# EAGLE schematic decoder (EAGLE 7.3.0)
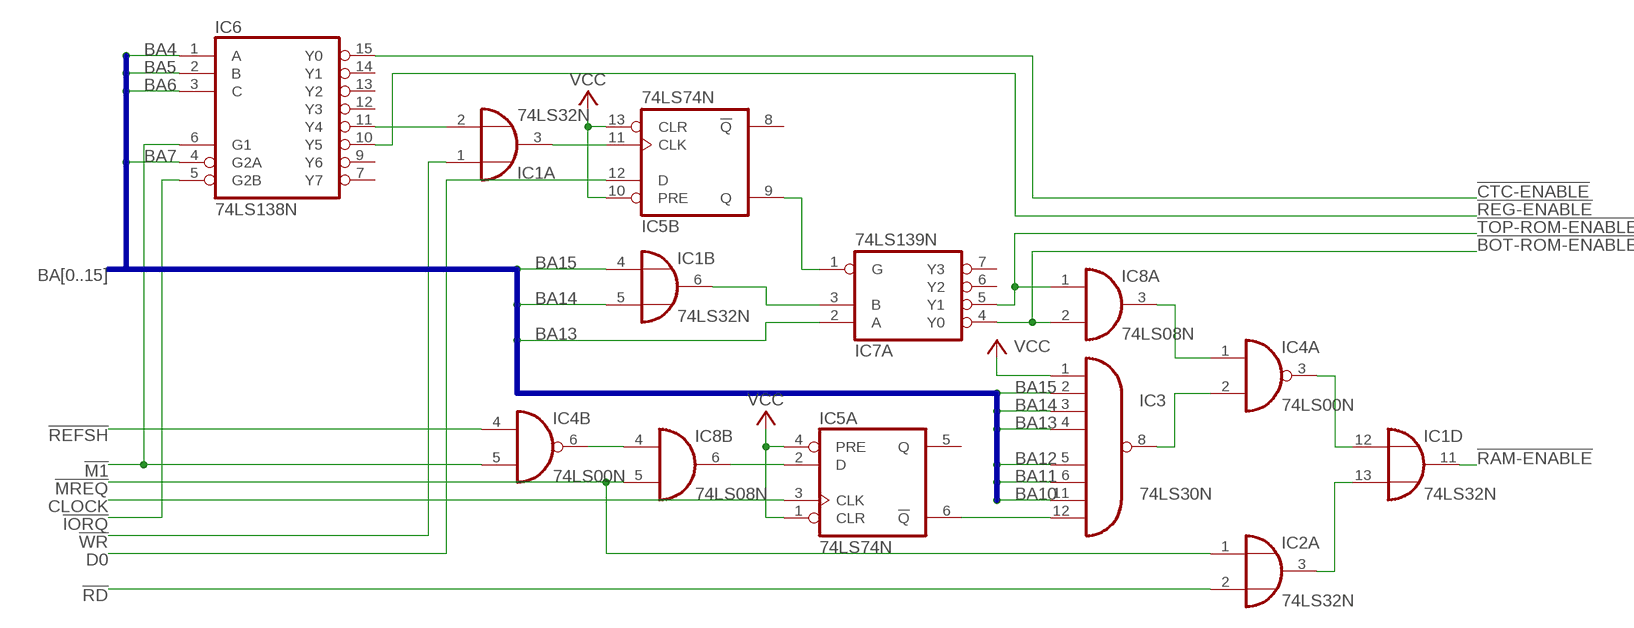
[diagram p0: schematic, sheet 1]

## Parts
IC1  74LS32N  [DIL14]
IC2  74LS32N  [DIL14]
IC3  74LS30N  [DIL14]
IC4  74LS00N  [DIL14]
IC5  74LS74N  [DIL14]
IC6  74LS138N  [DIL16]
IC7  74LS139N  [DIL16]
IC8  74LS08N  [DIL14]

## Nets
!BOT-ROM-ENABLE!: IC7.4(A:Y0) IC8.2(A:I1)
!CTC-ENABLE!: IC6.15(Y0)
!IORQ!: IC6.5(G2B)
!M1!: IC4.5(B:I1) IC6.6(G1)
!MREQ!: IC2.1(A:I0) IC8.5(B:I1)
!RAM-ENABLE!: IC1.11(D:O)
!RD!: IC2.2(A:I1)
!REFSH!: IC4.4(B:I0)
!REG-ENABLE!: IC6.10(Y5)
!TOP-ROM-ENABLE!: IC7.5(A:Y1) IC8.1(A:I0)
!WR!: IC1.1(A:I0)
BA4: IC6.1(A)
BA5: IC6.2(B)
BA6: IC6.3(C)
BA7: IC6.4(G2A)
BA10: IC3.11(I6)
BA11: IC3.6(I5)
BA12: IC3.5(I4)
BA13: IC3.4(I3) IC7.2(A:A)
BA14: IC1.5(B:I1) IC3.3(I2)
BA15: IC1.4(B:I0) IC3.2(I1)
CLOCK: IC5.3(A:CLK)
D0: IC5.12(B:D)
N$1: IC1.3(A:O) IC5.11(B:CLK)
N$2: IC5.9(B:Q) IC7.1(A:G)
N$3: IC1.2(A:I1) IC6.11(Y4)
N$4: IC1.6(B:O) IC7.3(A:B)
N$5: IC4.1(A:I0) IC8.3(A:O)
N$6: IC3.8(O) IC4.2(A:I1)
N$7: IC3.12(I7) IC5.6(A:!Q)
N$8: IC5.2(A:D) IC8.6(B:O)
N$9: IC4.6(B:O) IC8.4(B:I0)
N$14: IC1.12(D:I0) IC4.3(A:O)
N$15: IC1.13(D:I1) IC2.3(A:O)
VCC: IC3.1(I0) IC5.1(A:CLR) IC5.4(A:PRE) IC5.10(B:PRE) IC5.13(B:CLR)
Unconnected: IC1.8(C:O) IC1.9(C:I0) IC1.10(C:I1) IC2.4(B:I0) IC2.5(B:I1) IC2.6(B:O) IC2.8(C:O) IC2.9(C:I0) IC2.10(C:I1) IC2.11(D:O) IC2.12(D:I0) IC2.13(D:I1) IC4.8(C:O) IC4.9(C:I0) IC4.10(C:I1) IC4.11(D:O) IC4.12(D:I0) IC4.13(D:I1) IC5.5(A:Q) IC5.8(B:!Q) IC6.7(Y7) IC6.9(Y6) IC6.12(Y3) IC6.13(Y2) IC6.14(Y1) IC7.6(A:Y2) IC7.7(A:Y3) IC7.9(B:Y3) IC7.10(B:Y2) IC7.11(B:Y1) IC7.12(B:Y0) IC7.13(B:B) IC7.14(B:A) IC7.15(B:G) IC8.8(C:O) IC8.9(C:I0) IC8.10(C:I1) IC8.11(D:O) IC8.12(D:I0) IC8.13(D:I1)

## Buses
BA[0..15]

## Power pins joined to a net without a drawn wire
GND: IC1.7(P:GND) IC2.7(P:GND) IC3.7(GND) IC4.7(P:GND) IC5.7(P:GND) IC6.8(GND) IC7.8(P:GND) IC8.7(P:GND)
VCC: IC1.14(P:VCC) IC2.14(P:VCC) IC3.14(VCC) IC4.14(P:VCC) IC5.14(P:VCC) IC6.16(VCC) IC7.16(P:VCC) IC8.14(P:VCC)

## Library data of the parts
IC1 IC2 = 74xx-eu:74*32: Quad 2-input OR gate
IC3 = 74xx-eu:74*30: 8-input NAND gate
IC4 = 74xx-eu:74*00: Quad 2-input NAND gate
IC5 = 74xx-eu:74*74: Dual D type positive edge triggered FLIP FLOP, preset and clear
IC6 = 74xx-eu:74*138: 3-line to 8-line DECODER/DEMULTIPLEXER
IC7 = 74xx-eu:74*139: Dual 2-line to 4-line DECODER/DEMULTIPLEXER
IC8 = 74xx-eu:74*08: Quad 2-input AND gate